# Altium schematic sheet Interface_Current_Sensor_2.SchDoc
size A3; SPICEModelCacheQYDFTYGO: <root> / <DocumentId>QYDFTYGO</DocumentId> / <CacheFrame Number="0"> / <Model Name="npn" Kind="MDL"> / <Text>*Default NPN BJT / *NPN Trans Pinout: C,B,E / .MODEL NPN NPN()</Text> / </Model> / </CacheFrame> / </root>
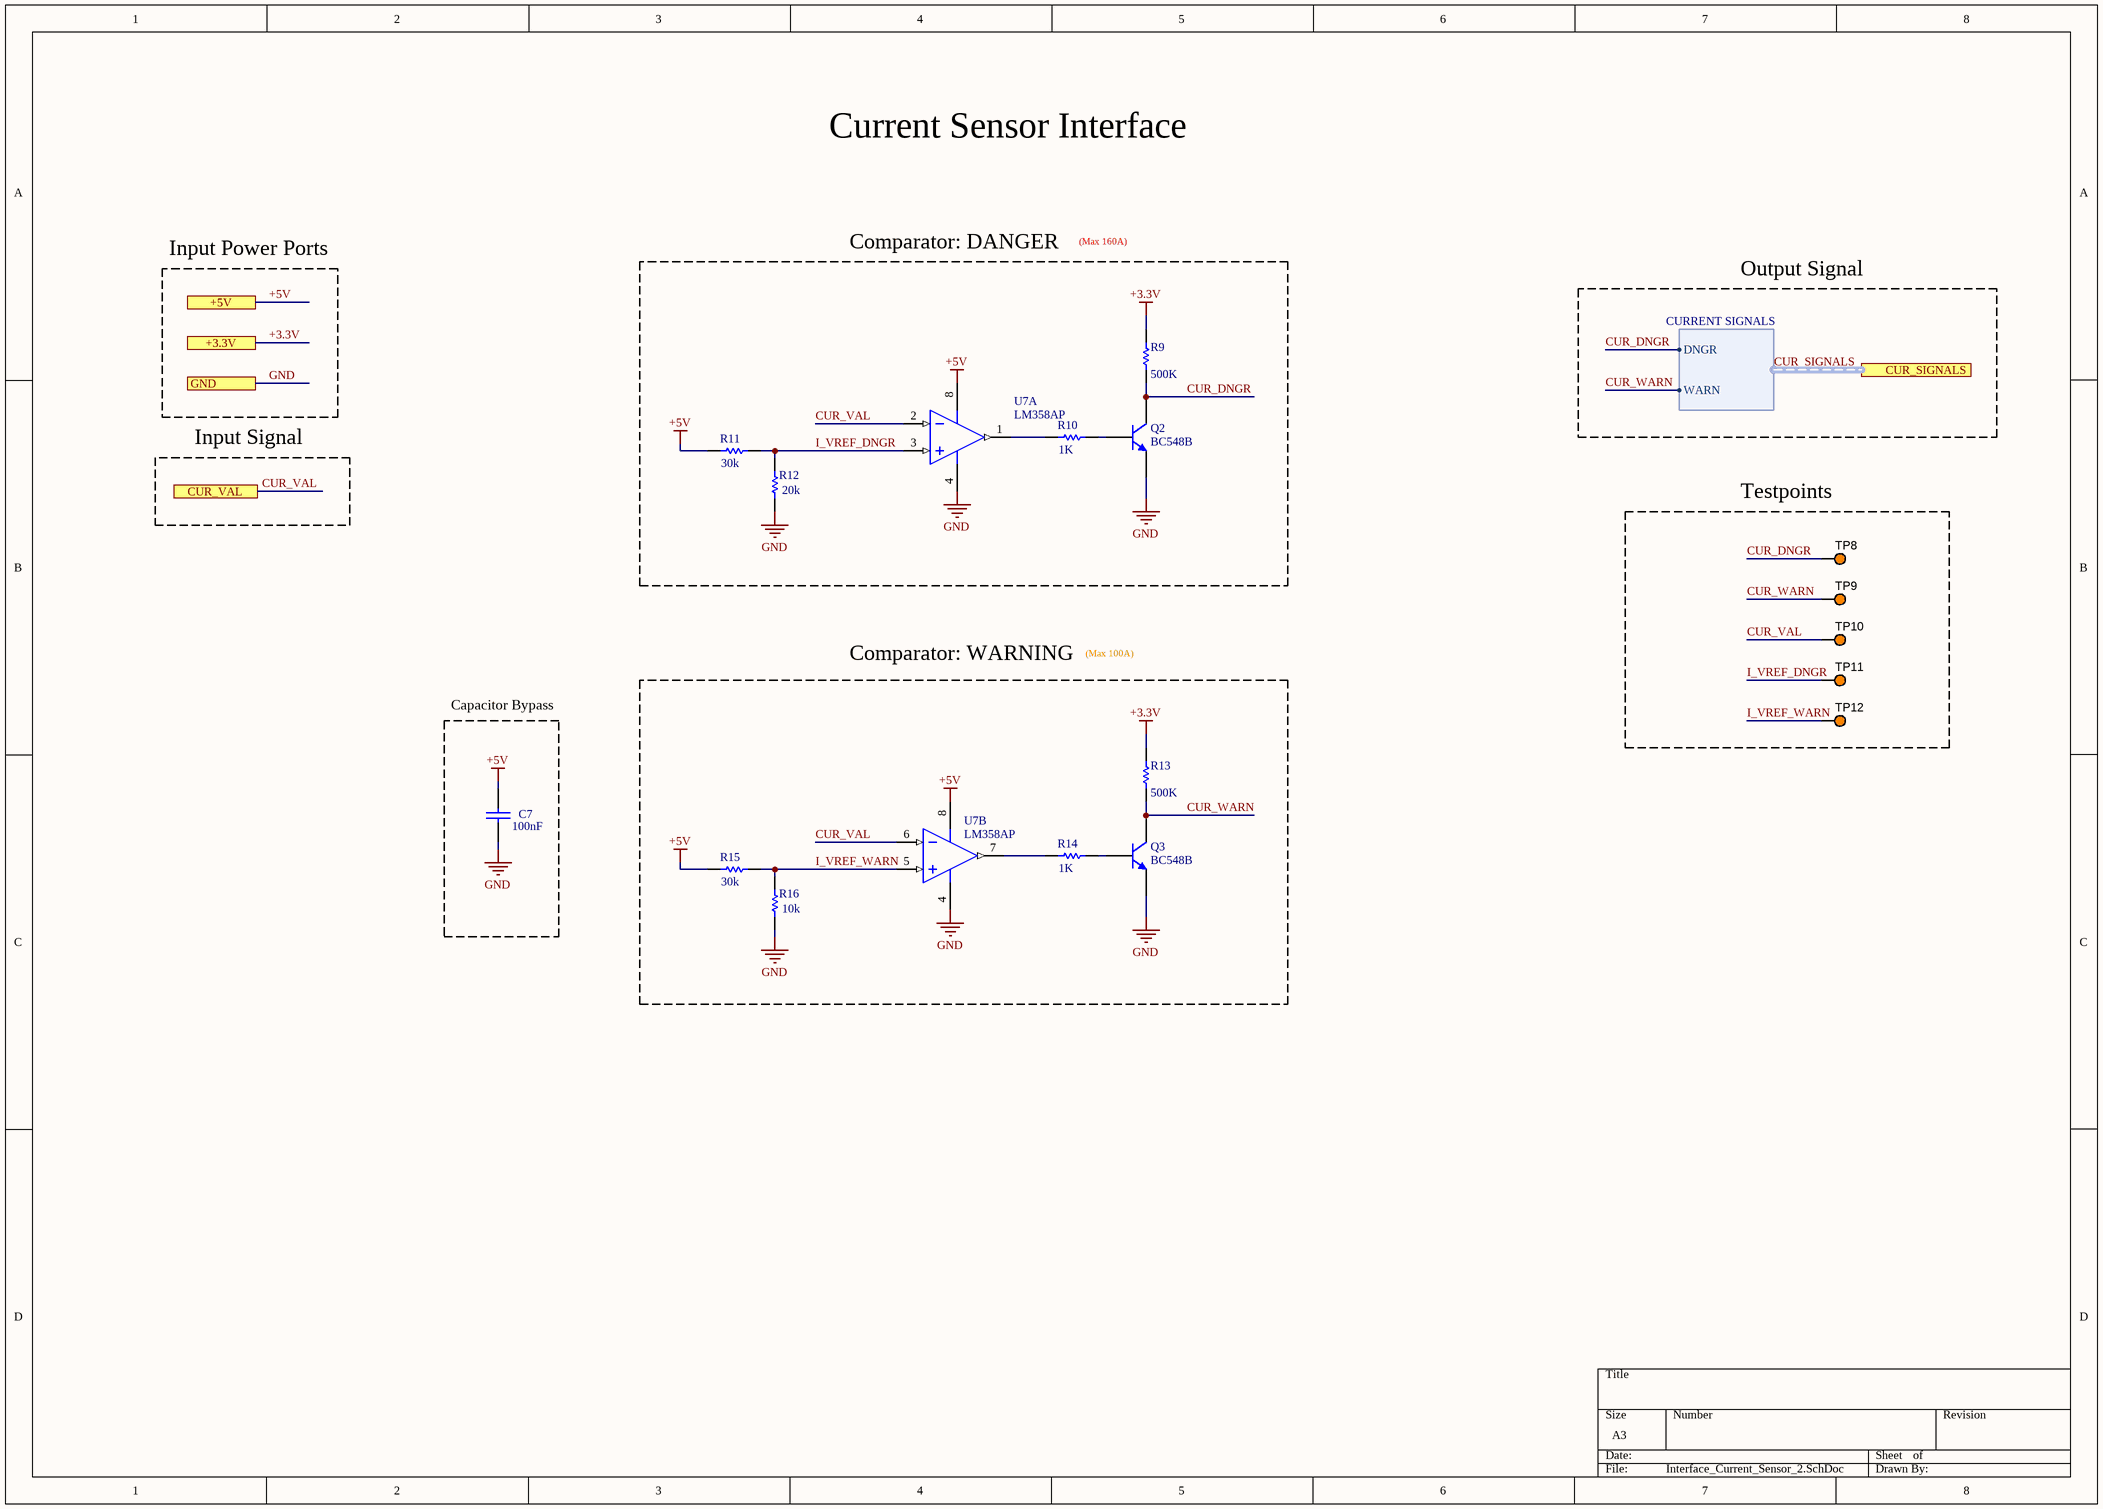
[diagram p0: Interface_Current_Sensor_2.SchDoc]

## Parts
C7  100nF  [CAP200]
Q2  BC548B  [TO-226-AA]
Q3  BC548B  [TO-226-AA]
R9  value 500K  [AXIAL-0.3]  (hidden comment: Res1)
R10  value 1K  [AXIAL-0.3]  (hidden comment: Res1)
R11  value 30k  [AXIAL-0.3]  (hidden comment: Res1)
R12  value 20k  [AXIAL-0.3]  (hidden comment: Res1)
R13  value 500K  [AXIAL-0.3]  (hidden comment: Res1)
R14  value 1K  [AXIAL-0.3]  (hidden comment: Res1)
R15  value 30k  [AXIAL-0.3]  (hidden comment: Res1)
R16  value 10k  [AXIAL-0.3]  (hidden comment: Res1)
TP8  5003  [KSTN-5003]  (value not drawn)
TP9  5003  [KSTN-5003]  (value not drawn)
TP10  5003  [KSTN-5003]  (value not drawn)
TP11  5003  [KSTN-5003]  (value not drawn)
TP12  5003  [KSTN-5003]  (value not drawn)
U7  LM358AP  [P0008A]  (parts A,B of 2)

## Blocks framed on the sheet
Comparator: DANGER: Q2 R9-R12 U7
Testpoints: TP8-TP12
Comparator: WARNING: Q3 R13-R16 U7
Capacitor Bypass: C7

## Ports
+3.3V, +5V, CUR_SIGNALS (harness CURRENT SIGNALS), CUR_VAL, GND

## Harnesses
CURRENT SIGNALS: DNGR, WARN

## Nets
+3.3V: R9.2 R13.2 ; port +3.3V
+5V: C7.1 R11.1 R15.1 U7.8(VCC) ; port +5V
GND: C7.2 Q2.3(E) Q3.3(E) R12.1 R16.1 U7.4(GND) ; port GND
CUR_DNGR: Q2.1(C) R9.1 TP8.1 ; port CUR_SIGNALS.DNGR
CUR_VAL: TP10.1 U7.2(1IN-) U7.6(2IN-) ; port CUR_VAL
CUR_WARN: Q3.1(C) R13.1 TP9.1 ; port CUR_SIGNALS.WARN  [project net CUR_SIGNALS.WARN]
I_VREF_DNGR: R11.2 R12.2 TP11.1 U7.3(1IN+)
I_VREF_WARN: R15.2 R16.2 TP12.1 U7.5(2IN+)
NetQ2_2: Q2.2(B) R10.2
NetQ3_2: Q3.2(B) R14.2
NetR10_1: R10.1 U7.1(1OUT)
NetR14_1: R14.1 U7.7(2OUT)

## Buses and harness runs
harness CUR_SIGNALS = port CUR_SIGNALS

## Notes on the sheet
- Current Sensor Interface
- (Max 160A)
- Input Power Ports
- Output Signal
- Input Signal
- (Max 100A)

## Library data of the parts
C7 = CAP
Q2 Q3 = NPN: NPN Bipolar Transistor; Published: 8-Jun-2000; LatestRevisionDate: 17-Jul-2002; LatestRevisionNote: Re-released for DXP Platform.; PackageReference: TO-226-AA; Publisher: Altium Limited; PackageDescription: TO, Flat Index; 3 In-Line, Axial Leads; Body Dia. 4.8mm; Leads 0.55 x 0.51 mm (max); Code_JEDEC: TO-226-AA
R9-R16 = Res1: Resistor; Published: 8-Jun-2000; LatestRevisionDate: 17-Jul-2002; LatestRevisionNote: Re-released for DXP Platform.; PackageReference: AXIAL-0.3; Publisher: Altium Limited; PackageDescription: Axial Device, Thru-Hole; 2 Leads; 0.3 in Pin Spacing
TP8-TP12 = CMP-002-00037-2: Test Point, Orange, Height 4.6 mm, Tail Length 3 mm, 1-Pin THD, RoHS; Manufacturer: Keystone; Colour: Orange; Packaging: Bulk; Package Description: 1-Pin Through Hole Device, Dia 2.54 mm; Pins: 1; Package Reference: 5003; Datasheet Version: Jun-15; Case/Package: 5003; Mounting Technology: TH; Connector Type: TestPoint; Diameter: 2.54mm; Contact Material: Bronze; Datasheet URL: http://keyelco.com/userAssets/file/M65p56.pdf; Manufacturer URL: http://www.keyelco.com/; Package Quantity: 10; Contact Plating: Tin; RoHS Compliant: True
U7 = CMP-014-00023-2: Dual Operational Amplifier, 3 to 32 V, 0 to 70 degC, 8-Pin PDIP (P), Pb-Free (RoHS), Tube; Manufacturer: Texas Instruments (TI); Channels: 2; Max Dual Supply Voltage: 16V; Min Dual Supply Voltage: 1.5V; Slew Rate: 0.3V/us; Unity Gain Bandwidth Product: 700KHz; Common Mode Rejection Ratio: 65dB; Nominal Supply Voltage: 5V; Package Version: 4040082/E, 04/2010; Output Current: 30mA; Nominal Supply Current: 1.2mA; Nominal Voltage Gain: 100dB; Case/Package: DIP; Max Operating Temperature: 70°C; RoHS Compliant: True; Manufacturer URL: http://www.ti.com/; Pins: 8; Package Description: 8-Pin Double In-line Package, Body 9.59 x 6.35 mm, Pitch 2.54 mm; Datasheet URL: http://www.ti.com/lit/ds/symlink/lm358a.pdf; Max Supply Voltage: 16V; Package Reference: P0008A; Mounting Technology: TH; Min Operating Temperature: 0°C; Package URL: http://www.ti.com/lit/ml/mpdi001b/mpdi001b.pdf; Min Supply Voltage: 1.5V; Package Quantity: 50; Packaging: Rail/Tube; Datasheet Version: SLOS068T, 04/2015; Nominal Gain Bandwith Product: 700KHz